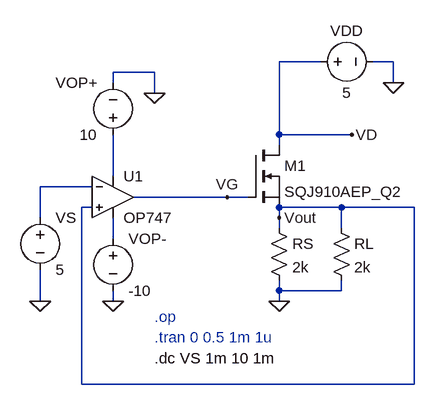
[diagram p0: schematic mos_cd_vgs.asc]
mos_cd_vgs.asc, the LTspice schematic file:
Version 4.1
SHEET 1 880 680
WIRE 256 0 192 0
WIRE 368 0 336 0
WIRE 0 16 -64 16
WIRE -64 32 -64 16
WIRE 368 32 368 0
WIRE 0 48 0 16
WIRE 192 112 192 0
WIRE 304 112 192 112
WIRE 192 128 192 112
WIRE -64 176 -64 112
WIRE -96 192 -176 192
WIRE 112 208 -32 208
WIRE 144 208 112 208
WIRE -96 224 -112 224
WIRE 288 224 192 224
WIRE 400 224 288 224
WIRE -176 240 -176 192
WIRE 192 240 192 224
WIRE 192 256 192 240
WIRE 288 256 288 224
WIRE -64 272 -64 240
WIRE 192 352 192 336
WIRE 288 352 288 336
WIRE 288 352 192 352
WIRE -176 368 -176 320
WIRE -64 368 -64 352
WIRE 192 368 192 352
WIRE -112 496 -112 224
WIRE 400 496 400 224
WIRE 400 496 -112 496
FLAG 192 368 0
FLAG 192 240 Vout
FLAG 368 32 0
FLAG 304 112 VD
FLAG 112 208 VG
FLAG -64 368 0
FLAG 0 48 0
FLAG -176 368 0
SYMBOL nmos 144 128 R0
SYMATTR InstName M1
SYMATTR Value SQJ910AEP_Q2
SYMBOL res 176 240 R0
SYMATTR InstName RS
SYMATTR Value 2k
SYMBOL voltage 240 0 R270
WINDOW 0 32 56 VTop 2
WINDOW 3 -32 56 VBottom 2
WINDOW 123 0 0 Left 0
WINDOW 39 0 0 Left 0
SYMATTR InstName VDD
SYMATTR Value 5
SYMBOL res 272 240 R0
SYMATTR InstName RL
SYMATTR Value 2k
SYMBOL OpAmps\\OP747 -64 144 R0
SYMATTR InstName U1
SYMBOL voltage -64 256 R0
WINDOW 123 0 0 Left 0
WINDOW 39 0 0 Left 0
SYMATTR InstName VOP-
SYMATTR Value -10
SYMBOL voltage -64 128 R180
WINDOW 0 24 96 Left 2
WINDOW 3 24 16 Left 2
WINDOW 123 0 0 Left 0
WINDOW 39 0 0 Left 0
SYMATTR InstName VOP+
SYMATTR Value 10
SYMBOL voltage -176 224 R0
WINDOW 123 0 0 Left 0
WINDOW 39 0 0 Left 0
SYMATTR InstName VS
SYMATTR Value 5
TEXT 0 392 Left 2 ;.op
TEXT 0 424 Left 2 ;.tran 0 0.5 1m 1u
TEXT 0 456 Left 2 !.dc VS 1m 10 1m

The netlist it stands for:
* mos_cd_vgs.asc
M1 VD VG Vout Vout SQJ910AEP_Q2
RS Vout 0 2k
VDD VD 0 5
RL Vout 0 2k
X§U1 Vout N002 N001 N003 VG OP747  ; pins In+ In- V+ V- OUT
VOP- N003 0 -10
VOP+ N001 0 10
VS N002 0 5
.model NMOS NMOS
.model PMOS PMOS
.lib standard.mos
* .op
* .tran 0 0.5 1m 1u
.dc VS 1m 10 1m
.backanno
.end

* Results of the author's LTspice run, read from the files saved beside the schematic
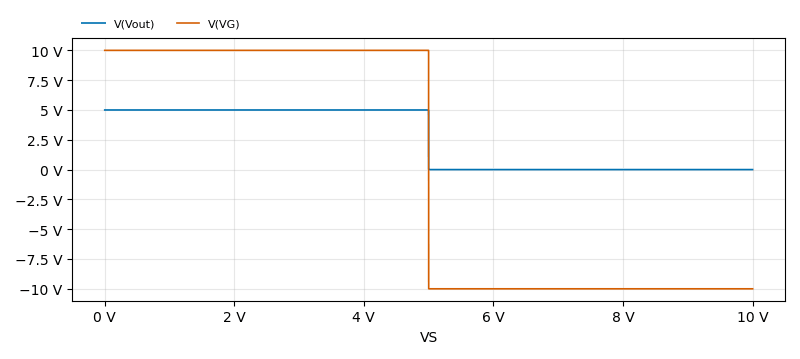
[diagram p1: DC transfer characteristic of mos_cd_vgs.asc, plotted from the saved traces]
* DC transfer characteristic, 1 run:
*   V(Vout): 5 V at VS=1 mV, 21.5 µV at VS=10 V, min 21.5 µV, max 5 V
*   V(VG): 10 V at VS=1 mV, -10 V at VS=10 V, min -10 V, max 10 V